# Altium project Bicycle-LED_Board - Brendan Cook.PrjPcb
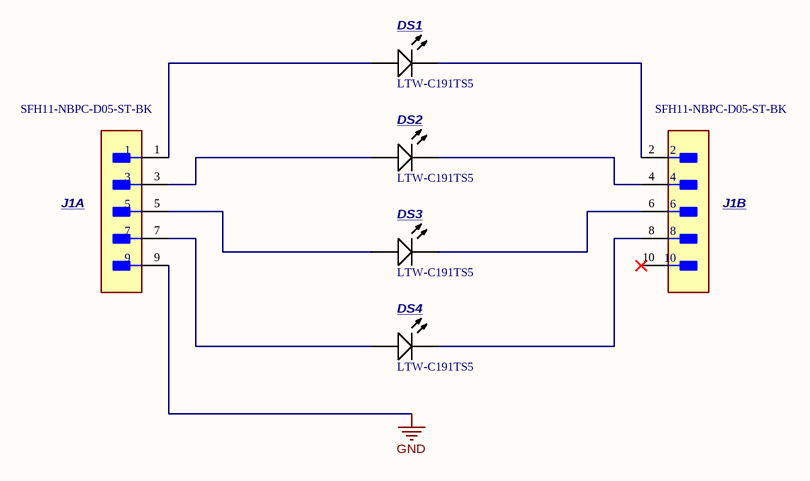
[diagram p0:  Sch-Bicycle-LED_Lamp Brd.SchDoc]
1 sheet, 5 parts. Net scope: global (net labels, ports and power ports of the same name join across sheets).
Board file:  BRD-Bicycle-LED Brd.PcbDoc

## Sheet  Sch-Bicycle-LED_Lamp Brd.SchDoc: SCH-Bicycle LED Lamp Brd
size A4; Date: 4/30/2024; ApprovedBy: AGC; CheckedBy: AGC; Author: Al Cyr; CompanyName: Altium; DrawnBy: Al Cyr; Engineer: Al Cyr; Organization: Altium; DocumentNumber: SCH-20240430; Revision: A; SheetNumber: 1; SheetTotal: 1

### Parts
DS1  LTW-C191TS5  [LTST-LTW-C191TS5_V]
DS2  LTW-C191TS5  [LTST-LTW-C191TS5_V]
DS3  LTW-C191TS5  [LTST-LTW-C191TS5_V]
DS4  LTW-C191TS5  [LTST-LTW-C191TS5_V]
J1  SFH11-NBPC-D05-ST-BK  [SFH11-NBPC-D05-ST-BK-Footprint-1]  (parts A,B of 2)

### Nets
GND: J1.9
NetDS1_1: DS1.1(A) J1.1
NetDS1_2: DS1.2(K) J1.2
NetDS2_1: DS2.1(A) J1.3
NetDS2_2: DS2.2(K) J1.4
NetDS3_1: DS3.1(A) J1.5
NetDS3_2: DS3.2(K) J1.6
NetDS4_1: DS4.1(A) J1.7
NetDS4_2: DS4.2(K) J1.8

Not connected (* = marked no-connect by the designer): J1 10*

### Notes on the sheet
- Project Number

### Library data of the parts
DS1-DS4 = CMP-007-00027-1: LED Uni-Color White, 70 mW, 20 mA, -20 to 80 degC, 2-Pin SMD, RoHS, Tape and Reel; Manufacturer: Lite-On; Forward Voltage: 3.15V; Viewing Angle: 130degrees; Forward Current: 5mA; Nominal Vf: 2.93V; Power: 70mW; Lens Style: Diffused; Luminous Intensity: 28mcd; RoHS Compliant: True; Mounting Technology: SM; Datasheet Version: Rev. B, 06/2010; Colour: White; Min Operating Temperature: -20°C; Package Quantity: 1; Datasheet URL: http://optoelectronics.liteon.com/upload/download/DS22-2004-201/S_110_LTW-C191TS5.pdf; Package Reference: LTW-C191TS5; Max Operating Temperature: 80°C; Case/Package: 0603; Illumination Colour: White; Pins: 2; Packaging: TapeandReel; Package Description: 2-Pin Surface Mount Device, Body 1.6 x 0.8 mm; Manufacturer URL: http://www.us.liteon.com/
J1 = CMP-002-00256-2: Conn Hdr 10POS 0.1 Gold Pcb; Mating Contact Pitch: 0.1inch; Connector Type: BOARD CONNECTOR; Contact Style: SQ PIN-SKT; Number Of PCB Rows: 2; Contact Pattern: RECTANGULAR; Body Depth: 0.335inch; Body Breadth: 0.276inch; Body Length: 0.7inch; Dielectric Withstanding Voltage (AC): 500V; Number of Contacts: 10; System: Connector; Max Operating Temperature: 105°C; Min Operating Temperature: -40°C; RoHS Compliant: Yes; Contact Gender: Female; Mounting Technology: Board; Contact Finish - Mating: AU; Mounting Style: STRAIGHT; Contact Finish - Termination: GOLD; Mating Contact Row Spacing: 0.1inch